# Altium schematic sheet AirshipBoard.SchDoc: 飞艇控制集成板
size A3; Date: 2015.9.27; DrawnBy: Niu; Revision: 1.0; PageSetup: Record=PageOptions|CenterHorizontal=True|CenterVertical=True|PrintScale=1.42|XCorrection=1.00|YCorrection=1.00|PrintKind=1|BorderSize=5000000|LeftOffset=0|BottomOffset=0|Orientation=2|PaperLength=1000|PaperWidth=1000|Scale=100|PaperSource=7|PrintQuality=-3|MediaType=1|DitherType=10|PrintScaleMode=1|PaperKind=A3|PaperIndex=8
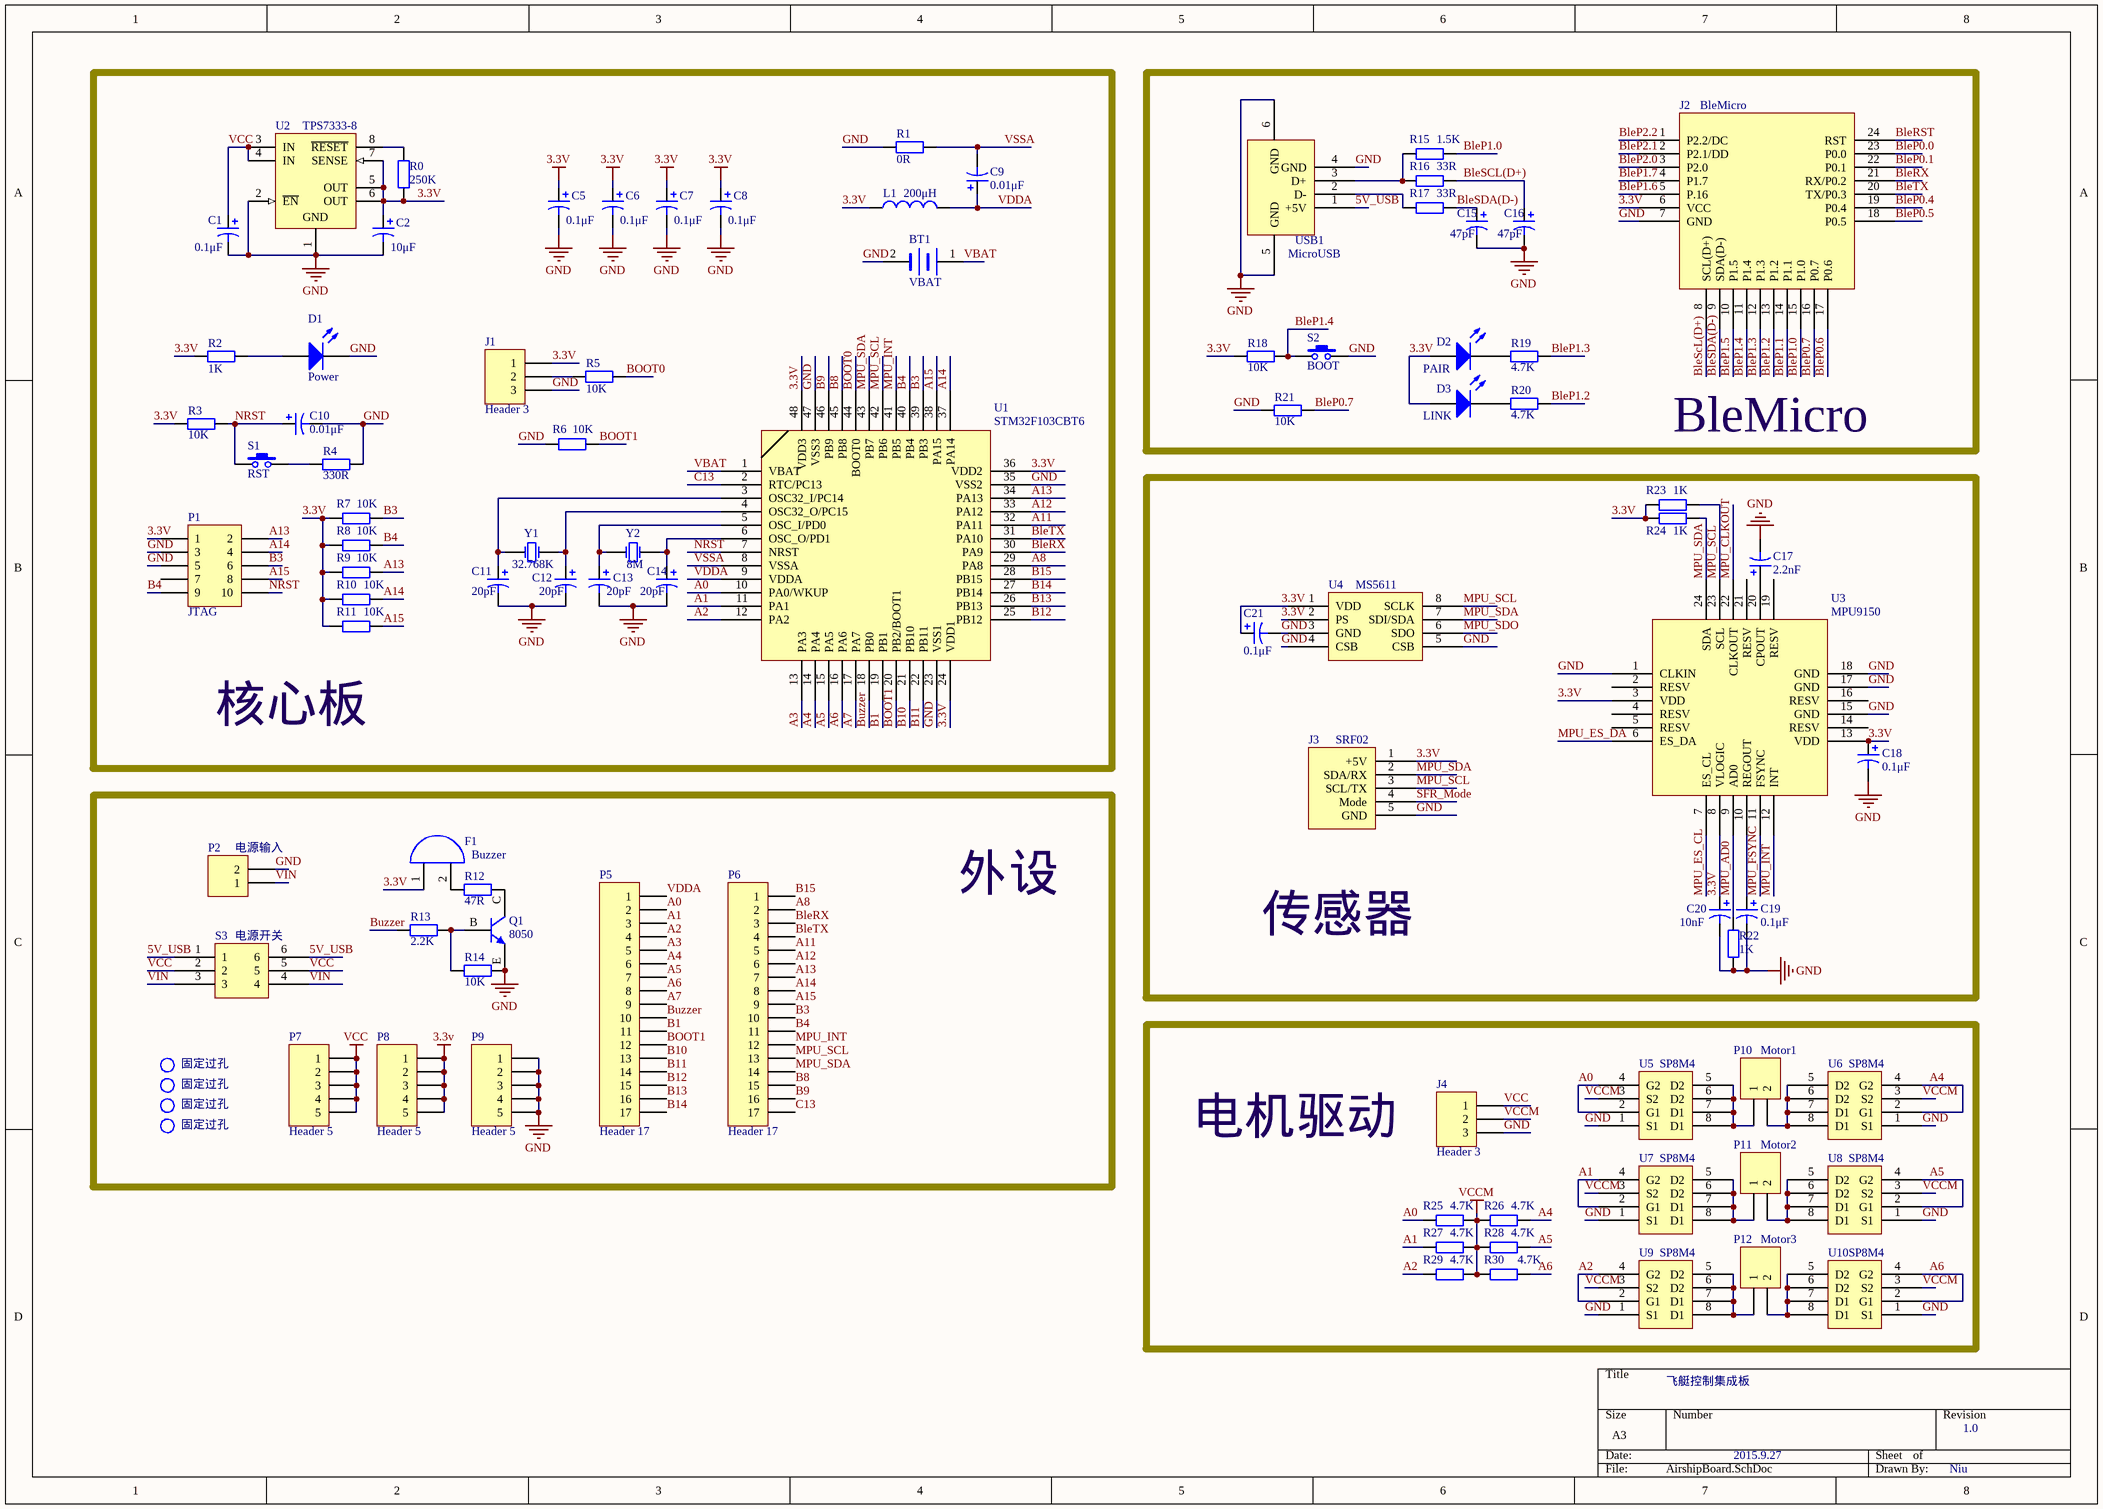
[diagram p0: AirshipBoard.SchDoc]

## Parts
BT1  VBAT  [BAT-SOT]
C1  value 0.1μF  [C0805]  (hidden comment: Cap Pol3)
C2  value 10μF  [C0805]  (hidden comment: Cap Pol3)
C5  value 0.1μF  [C0805]  (hidden comment: Cap Pol3)
C6  value 0.1μF  [C0805]  (hidden comment: Cap Pol3)
C7  value 0.1μF  [C0805]  (hidden comment: Cap Pol3)
C8  value 0.1μF  [C0805]  (hidden comment: Cap Pol3)
C9  value 0.01μF  [C0805]  (hidden comment: Cap Pol3)
C10  value 0.01μF  [C0805]  (hidden comment: Cap Pol3)
C11  value 20pF  [C0805]  (hidden comment: Cap Pol3)
C12  value 20pF  [C0805]  (hidden comment: Cap Pol3)
C13  value 20pF  [C0805]  (hidden comment: Cap Pol3)
C14  value 20pF  [C0805]  (hidden comment: Cap Pol3)
C15  value 47pF  [C0805]  (hidden comment: Cap Pol3)
C16  value 47pF  [C0805]  (hidden comment: Cap Pol3)
C17  value 2.2nF  [C0805]  (hidden comment: Cap Pol3)
C18  value 0.1μF  [C0805]  (hidden comment: Cap Pol3)
C19  value 0.1μF  [C0805]  (hidden comment: Cap Pol3)
C20  value 10nF  [C0805]  (hidden comment: Cap Pol3)
C21  value 0.1μF  [C0805]  (hidden comment: Cap Pol3)
D1  Power  [3.2X1.6X1.1]
D2  PAIR  [3.2X1.6X1.1]
D3  LINK  [3.2X1.6X1.1]
F1  Buzzer  [BELL]
g1  固定过孔  [HOLE_3MM-2]
g2  固定过孔  [HOLE_3MM-2]
g3  固定过孔  [HOLE_3MM-2]
g4  固定过孔  [HOLE_3MM-2]
J1  Header 3  [HDR1X3]
J2  BleMicro  [BleMicro]
J3  SRF02  [SRF02]
J4  Header 3  [HDR1X3]
L1  value 200μH  [6-0805_N]  (hidden comment: Inductor)
P1  JTAG  [HDR2X5]
P2  电源输入  [HDR1X2]
P5  Header 17  [HDR1X17]
P6  Header 17  [HDR1X17]
P7  Header 5  [HDR1X5]
P8  Header 5  [HDR1X5]
P9  Header 5  [HDR1X5]
P10  Motor1  [HDR1X2]
P11  Motor2  [HDR1X2]
P12  Motor3  [HDR1X2]
Q1  8050  [SOT-23(BEC-123)]
R0  value 250K  [6-0805_N]  (hidden comment: Res2)
R1  value 0R  [6-0805_N]  (hidden comment: Res2)
R2  value 1K  [6-0805_N]  (hidden comment: Res2)
R3  value 10K  [6-0805_N]  (hidden comment: Res2)
R4  value 330R  [6-0805_N]  (hidden comment: Res2)
R5  value 10K  [6-0805_N]  (hidden comment: Res2)
R6  value 10K  [6-0805_N]  (hidden comment: Res2)
R7  value 10K  [6-0805_N]  (hidden comment: Res2)
R8  value 10K  [6-0805_N]  (hidden comment: Res2)
R9  value 10K  [6-0805_N]  (hidden comment: Res2)
R10  value 10K  [6-0805_N]  (hidden comment: Res2)
R11  value 10K  [6-0805_N]  (hidden comment: Res2)
R12  value 47R  [6-0805_N]  (hidden comment: Res2)
R13  value 2.2K  [6-0805_N]  (hidden comment: Res2)
R14  value 10K  [6-0805_N]  (hidden comment: Res2)
R15  value 1.5K  [6-0805_N]  (hidden comment: Res2)
R16  value 33R  [6-0805_N]  (hidden comment: Res2)
R17  value 33R  [6-0805_N]  (hidden comment: Res2)
R18  value 10K  [6-0805_N]  (hidden comment: Res2)
R19  value 4.7K  [6-0805_N]  (hidden comment: Res2)
R20  value 4.7K  [6-0805_N]  (hidden comment: Res2)
R21  value 10K  [6-0805_N]  (hidden comment: Res2)
R22  value 1K  [6-0805_N]  (hidden comment: Res2)
R23  value 1K  [6-0805_N]  (hidden comment: Res2)
R24  value 1K  [6-0805_N]  (hidden comment: Res2)
R25  value 4.7K  [6-0805_N]  (hidden comment: Res2)
R26  value 4.7K  [6-0805_N]  (hidden comment: Res2)
R27  value 4.7K  [6-0805_N]  (hidden comment: Res2)
R28  value 4.7K  [6-0805_N]  (hidden comment: Res2)
R29  value 4.7K  [6-0805_N]  (hidden comment: Res2)
R30  value 4.7K  [6-0805_N]  (hidden comment: Res2)
S1  RST  [SW-0606]
S2  BOOT  [SW-0606]
S3  电源开关  [自锁开关-5.8*5.8]
U1  STM32F103CBT6  [LQFP48]
U2  TPS7333-8  [TPS73XX-8]
U3  MPU9150  [LCC24]
U4  MS5611  [LCC8]
U5  SP8M4  [TPS73XX-8]
U6  SP8M4  [TPS73XX-8]
U7  SP8M4  [TPS73XX-8]
U8  SP8M4  [TPS73XX-8]
U9  SP8M4  [TPS73XX-8]
U10  SP8M4  [TPS73XX-8]
USB1  MicroUSB  [MICROUSB_D2S6]
Y1  32.768K  [OSC_3X8d]
Y2  8M  [XTAL-HC49S]

## Blocks framed on the sheet
核心板: BT1 C1 C2 C5-C14 D1 J1 L1 P1 R0-R11 S1 U1 U2 Y1 Y2
BleMicro: C15 C16 D2 D3 J2 R15-R21 S2 USB1
传感器: C17-C21 J3 R22-R24 U3 U4
外设: F1 g1-g4 P2 P5-P9 Q1 R12-R14 S3
电机驱动: J4 P10-P12 R25-R30 U5-U10

## Nets
3.3V: C2.1 C5.1 C6.1 C7.1 C8.1 C18.1 C20.1 C21.1 D2.1(A) D3.1(A) F1.1(A) J1.1 J2.6(VCC) J3.1(+5V) L1.1 P1.1 P8.1 P8.2 P8.3 P8.4 P8.5 R0.1 R2.1 R3.2 R7.1 R8.1 R9.1 R10.1 R11.1 R18.2 R23.1 R24.1 U1.24(VDD1) U1.36(VDD2) U1.48(VDD3) U2.5(OUT) U2.6(OUT) U2.7(SENSE) U3.3(VDD) U3.8(VLOGIC) U3.13(VDD) U4.1(VDD) U4.2(PS)
GND: BT1.2(-) C1.2 C2.2 C5.2 C6.2 C7.2 C8.2 C10.2 C11.2 C12.2 C13.2 C14.2 C15.2 C16.2 C17.2 C18.2 C19.2 C20.2 C21.2 D1.2(K) J1.3 J2.7(GND) J3.5(GND) J4.3 P1.3 P1.5 P2.2 P9.1 P9.2 P9.3 P9.4 P9.5 Q1.E R1.1 R4.1 R6.1 R14.2 R21.2 R22.2 S2.2 U1.23(VSS1) U1.35(VSS2) U1.47(VSS3) U2.1(GND) U2.2(~{EN}) U3.1(CLKIN) U3.15(GND) U3.17(GND) U3.18(GND) U4.3(GND) U4.4(CSB) U4.5(CSB) U5.1(S1) U6.1(S1) U7.1(S1) U8.1(S1) U9.1(S1) U10.1(S1) USB1.4(GND) USB1.5(GND) USB1.6(GND)
VCC: C1.1 J4.1 P7.1 P7.2 P7.3 P7.4 P7.5 S3.2 S3.5 U2.3(IN) U2.4(IN)
VCCM: J4.2 R25.2 R26.1 R27.2 R28.1 R29.2 R30.1 U5.3(S2) U6.3(S2) U7.3(S2) U8.3(S2) U9.3(S2) U10.3(S2)
5V_USB: S3.1 S3.6 USB1.1(+5V)
A0: P5.2 R25.1 U1.10(PA0/WKUP) U5.2(G1) U5.4(G2)
A1: P5.3 R27.1 U1.11(PA1) U7.2(G1) U7.4(G2)
A2: P5.4 R29.1 U1.12(PA2) U9.2(G1) U9.4(G2)
A3: P5.5 U1.13(PA3)
A4: P5.6 R26.2 U1.14(PA4) U6.2(G1) U6.4(G2)
A5: P5.7 R28.2 U1.15(PA5) U8.2(G1) U8.4(G2)
A6: P5.8 R30.2 U1.16(PA6) U10.2(G1) U10.4(G2)
A7: P5.9 U1.17(PA7)
A8: P6.2 U1.29(PA8)
A11: P6.5 U1.32(PA11)
A12: P6.6 U1.33(PA12)
A13: P1.2 P6.7 R9.2 U1.34(PA13)
A14: P1.4 P6.8 R10.2 U1.37(PA14)
A15: P1.8 P6.9 R11.2 U1.38(PA15)
B1: P5.11 U1.19(PB1)
B3: P1.6 P6.10 R7.2 U1.39(PB3)
B4: P1.9 P6.11 R8.2 U1.40(PB4)
B8: P6.15 U1.45(PB8)
B9: P6.16 U1.46(PB9)
B10: P5.13 U1.21(PB10)
B11: P5.14 U1.22(PB11)
B12: P5.15 U1.25(PB12)
B13: P5.16 U1.26(PB13)
B14: P5.17 U1.27(PB14)
B15: P6.1 U1.28(PB15)
BleP0.0: J2.23(P0.0)
BleP0.1: J2.22(P0.1)
BleP0.4: J2.19(P0.4)
BleP0.5: J2.18(P0.5)
BleP0.6: J2.17(P0.6)
BleP0.7: J2.16(P0.7) R21.1
BleP1.0: J2.15(P1.0) R15.2
BleP1.1: J2.14(P1.1)
BleP1.2: J2.13(P1.2) R20.1
BleP1.3: J2.12(P1.3) R19.1
BleP1.4: J2.11(P1.4) R18.1 S2.1
BleP1.5: J2.10(P1.5)
BleP1.6: J2.5(P.16)
BleP1.7: J2.4(P1.7)
BleP2.0: J2.3(P2.0)
BleP2.1: J2.2(P2.1/DD)
BleP2.2: J2.1(P2.2/DC)
BleRST: J2.24(RST)
BleRX: J2.21(RX/P0.2) P6.3 U1.30(PA9)
BleSCL(D+): C16.1 J2.8(SCL(D+)) R16.2
BleSDA(D-): C15.1 J2.9(SDA(D-)) R17.2
BleTX: J2.20(TX/P0.3) P6.4 U1.31(PA10)
BOOT0: R5.2 U1.44(BOOT0)
BOOT1: P5.12 R6.2 U1.20(PB2/BOOT1)
Buzzer: P5.10 R13.1 U1.18(PB0)
C13: P6.17 U1.2(RTC/PC13)
MPU_AD0: R22.1 U3.9(AD0)
MPU_CLKOUT: U3.22(CLKOUT)
MPU_ES_CL: U3.7(ES_CL)
MPU_ES_DA: U3.6(ES_DA)
MPU_FSYNC: U3.11(FSYNC)
MPU_INT: P6.12 U1.41(PB5) U3.12(INT)
MPU_SCL: J3.3(SCL/TX) P6.13 R23.2 U1.42(PB6) U3.23(SCL) U4.8(SCLK)
MPU_SDA: J3.2(SDA/RX) P6.14 R24.2 U1.43(PB7) U3.24(SDA) U4.7(SDI/SDA)
MPU_SDO: U4.6(SDO)
NRST: C10.1 P1.10 R3.1 S1.1 U1.7(NRST)
SFR_Mode: J3.4(Mode)
VBAT: BT1.1(+) U1.1(VBAT)
VDDA: C9.1 L1.2 P5.1 U1.9(VDDA)
VIN: P2.1 S3.3 S3.4
VSSA: C9.2 R1.2 U1.8(VSSA)
NetC11_1: C11.1 U1.3(OSC32_I/PC14) Y1.1(OSC1)
NetC12_1: C12.1 U1.4(OSC32_O/PC15) Y1.2(OSC2)
NetC13_1: C13.1 U1.5(OSC_I/PD0) Y2.1(OSC1)
NetC14_1: C14.1 U1.6(OSC_O/PD1) Y2.2(OSC2)
NetC17_1: C17.1 U3.20(CPOUT)
NetC19_1: C19.1 U3.10(REGOUT)
NetD1_1: D1.1(A) R2.2
NetD2_2: D2.2(K) R19.2
NetD3_2: D3.2(K) R20.2
NetF1_2: F1.2(B) R12.1
NetJ1_2: J1.2 R5.1
NetP10_1: P10.1 U5.5(D2) U5.6(D2) U5.7(D1) U5.8(D1)
NetP10_2: P10.2 U6.5(D2) U6.6(D2) U6.7(D1) U6.8(D1)
NetP11_1: P11.1 U7.5(D2) U7.6(D2) U7.7(D1) U7.8(D1)
NetP11_2: P11.2 U8.5(D2) U8.6(D2) U8.7(D1) U8.8(D1)
NetP12_1: P12.1 U9.5(D2) U9.6(D2) U9.7(D1) U9.8(D1)
NetP12_2: P12.2 U10.5(D2) U10.6(D2) U10.7(D1) U10.8(D1)
NetQ1_B: Q1.B R13.2 R14.1
NetQ1_C: Q1.C R12.2
NetR0_2: R0.2 U2.8(~{RESET})
NetR4_2: R4.2 S1.2
NetR15_1: R15.1 R16.1 USB1.3(D+)
NetR17_1: R17.1 USB1.2(D-)

Not connected (* = marked no-connect by the designer): P1 7; U3 2(RESV) 4(RESV) 5(RESV) 14(RESV) 16(RESV) 19(RESV) 21(RESV)

## Library data of the parts
BT1 = BAT: Battery/VBAT
C1 C2 C5-C21 = Cap Pol3: Polarized Capacitor (Surface Mount); Published: 8-Jun-2000; LatestRevisionDate: 29-May-2009; LatestRevisionNote: IPC-7351 Footprint Added.; PackageReference: C0805; Publisher: Altium Limited; PackageDescription: Chip Capacitor
D1-D3 = LED2: Typical RED, GREEN, YELLOW, AMBER GaAs LED; Published: 8-Jun-2000; LatestRevisionDate: 17-Jul-2002; LatestRevisionNote: Re-released for DXP Platform.; PackageVersion: Feb-2002; PackageReference: 3.2X1.6X1.1; Publisher: Altium Limited; PackageDescription: SM LED; 2 Flat Leads
F1 = BELL
g1-g4 = g固定过孔: Comm: g固定过孔
J1 J4 = Header 3: Header, 3-Pin; LatestRevisionDate: 17-Jul-2002; LatestRevisionNote: Re-released for DXP Platform.; Publisher: Altium Limited
L1 = Inductor: Code_IEC: 1005; Published: 8-Jun-2000; LatestRevisionDate: 29-May-2009; LatestRevisionNote: IPC-7351 Footprint Added.; PackageReference: 0402-A; Publisher: Altium Limited; PackageDescription: Chip Inductor; Code_JEITA: 0402
P1 = Header 5X2: Header, 5-Pin, Dual row; LatestRevisionDate: 17-Jul-2002; LatestRevisionNote: Re-released for DXP Platform.; Publisher: Altium Limited
P2 P10-P12 = Header 2: USART; LatestRevisionDate: 17-Jul-2002; LatestRevisionNote: Re-released for DXP Platform.; Publisher: Altium Limited
P5 P6 = Header 17: Header, 17-Pin; LatestRevisionDate: 17-Jul-2002; LatestRevisionNote: Re-released for DXP Platform.; Publisher: Altium Limited
P7-P9 = Header 5: Header, 5-Pin; LatestRevisionDate: 17-Jul-2002; LatestRevisionNote: Re-released for DXP Platform.; Publisher: Altium Limited
Q1 = NPN
R0-R30 = Res2: Resistor; Published: 8-Jun-2000; LatestRevisionDate: 17-Jul-2002; LatestRevisionNote: Re-released for DXP Platform.; PackageReference: AXIAL-0.4; Publisher: Altium Limited; PackageDescription: Axial Device, Thru-Hole; 2 Leads; 0.4 in Pin Spacing
S1 S2 = SW-PB: Switch; Published: 24-Mar-1999; LatestRevisionDate: 17-Jul-2002; LatestRevisionNote: Re-released for DXP Platform.; PackageReference: SPST-2; Publisher: Altium Limited
S3 = 自锁开关
U1 = STM32F103C8T6: LQFP48
U2 = TPS73XX-8
USB1 = USB
Y1 Y2 = J晶振-3